# EAGLE design watering_board (EAGLE 9.6.2)
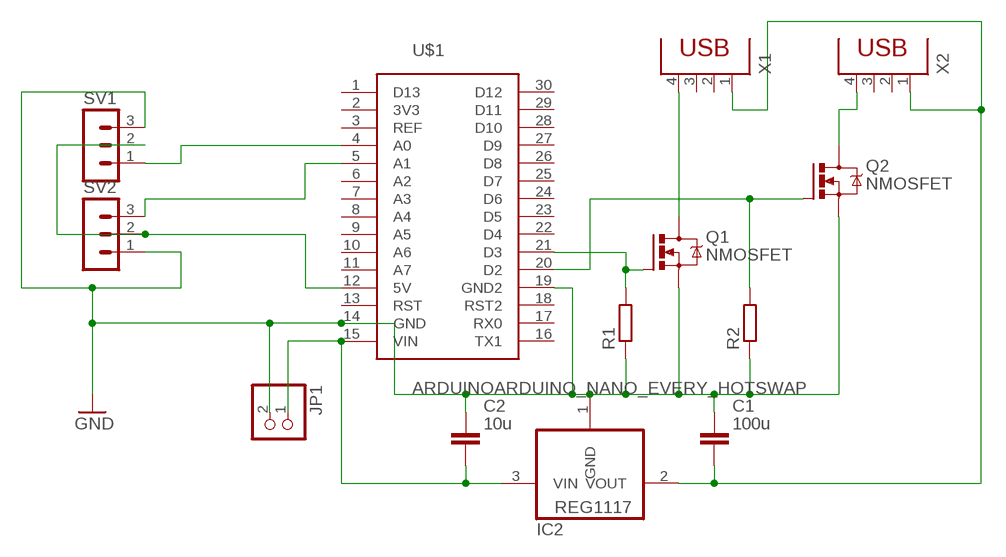
[diagram p0: schematic, sheet 1]

## Parts
C1  100u  C_CHIP-1206(3216-METRIC)  [CAPC3216X135]
C2  10u  C_CHIP-1206(3216-METRIC)  [CAPC3216X135]
IC2  REG1117  [SOT223]
JP1  PINHD-1X2  [1X02]
Q1  NMOSFET  NMOSFETSOT23  [SOT23]
Q2  NMOSFET  NMOSFETSOT23  [SOT23]
R1  R-EU_M1206  [M1206]
R2  R-EU_M1206  [M1206]
SV1  MA03-1  [MA03-1]
SV2  MA03-1  [MA03-1]
U$1  ARDUINOARDUINO_NANO_EVERY_HOTSWAP  [DIP1524W80P254L4318H508Q30B]
X1  PN87520  [PN87520]
X2  PN87520  [PN87520]

## Nets
GND: C1.1 C2.1 IC2.1(GND) JP1.2 Q1.2(S) Q2.2(S) R1.1 R2.1 SV1.3 SV2.1 U$1.14(GND) U$1.19(GND2)
N$1: SV1.1 U$1.4(A0)
N$2: SV2.3 U$1.5(A1)
N$3: SV1.2 SV2.2 U$1.12(5V)
N$4: C2.2 IC2.3(VIN) JP1.1 U$1.15(VIN)
N$5: Q2.1(G) R2.2 U$1.20(D2)
N$6: Q1.3(D) X1.4
N$7: Q2.3(D) X2.4
N$8: Q1.1(G) R1.2 U$1.21(D3)
N$9: C1.2 IC2.2(VOUT) X1.1 X2.1
Unconnected: U$1.1(D13) U$1.3(REF) U$1.6(A2) U$1.7(A3) U$1.8(A4) U$1.9(A5) U$1.10(A6) U$1.11(A7) U$1.13(RST) U$1.16(TX1) U$1.17(RX0) U$1.18(RST2) U$1.22(D4) U$1.23(D5) U$1.24(D6) U$1.25(D7) U$1.26(D8) U$1.27(D9) U$1.28(D10) U$1.29(D11) U$1.30(D12) X1.2 X1.3 X2.2 X2.3

## Power pins joined to a net without a drawn wire
3V3: U$1.2(3V3)

## Library data of the parts
C1 C2 = Capacitor:C: Capacitor - Generic; CATEGORY: Capacitor
IC2 = burr-brown:REG1117: 800mA and 1A Low Dropout (LDO) Positive Regulator 1.8V, 2.5V, 2.85V, 3.3V, 5V, and Adj; MPN: REG1117; OC_FARNELL: 1097566; OC_NEWARK: 14P6981
JP1 = pinhead:PINHD-1X2: PIN HEADER
Q1 Q2 = Transistor:NMOSFET: N-Channel MOSFET - Generic; CATEGORY: Transistor; SUB-CATEGORY: MOSFET; TYPE: N-Channel
R1 R2 = rcl:R-EU_: RESISTOR, European symbol; SPICEPREFIX: R
SV1 SV2 = con-lstb:MA03-1: PIN HEADER; OC_FARNELL: unknown; OC_NEWARK: unknown
U$1 = eScooter:ARDUINO: Ardino nano
X1 X2 = con-berg:PN87520: BERG USB connector; OC_FARNELL: unknown; OC_NEWARK: unknown

## Board
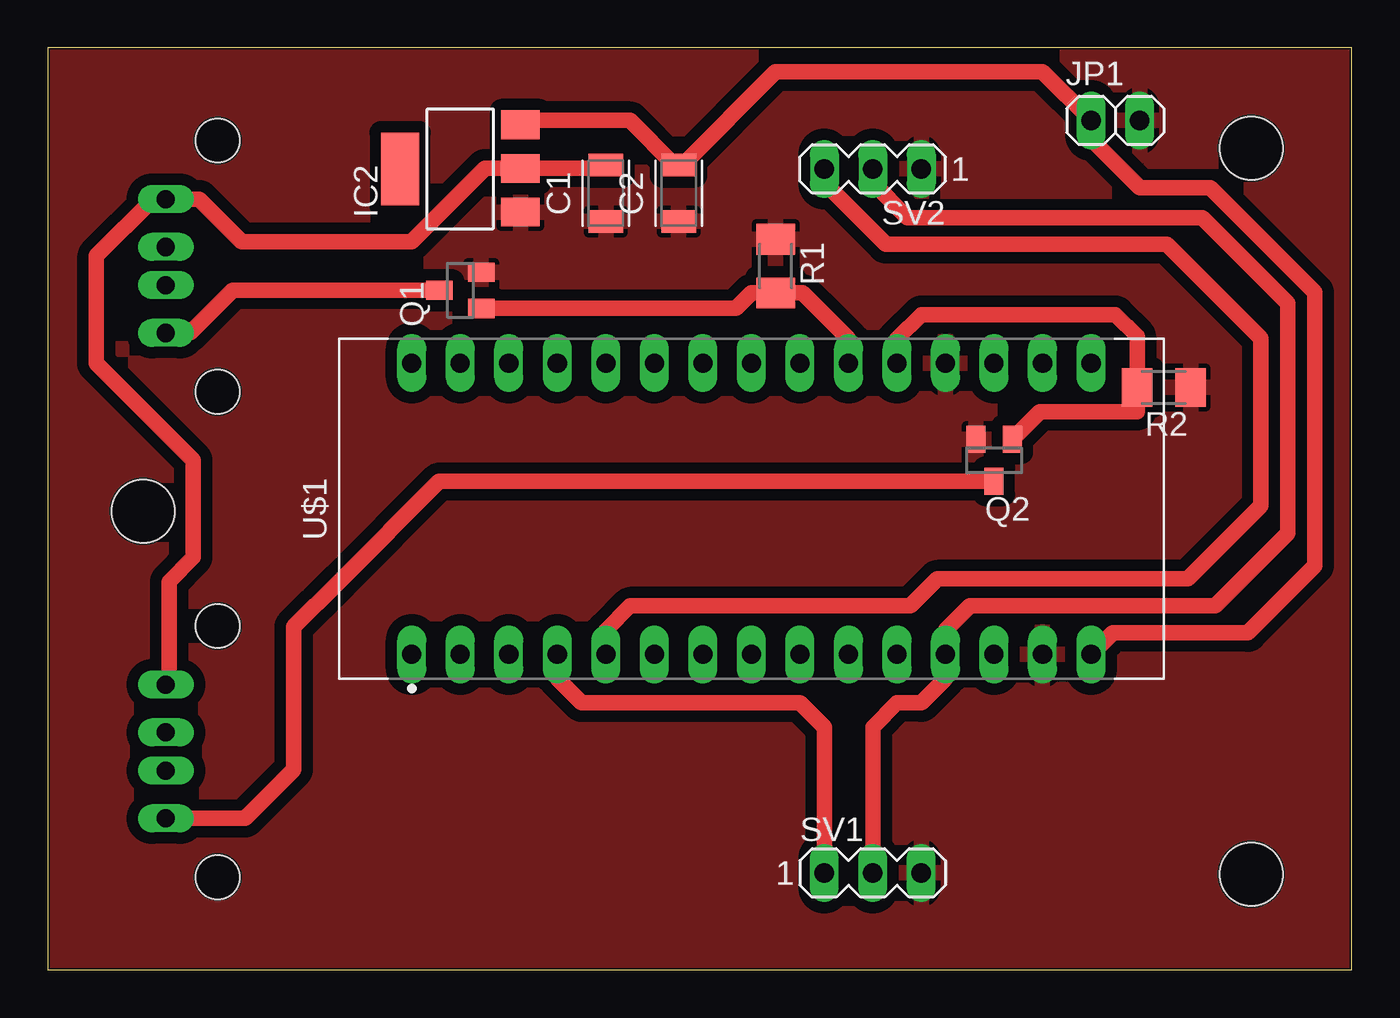
[diagram p1: board, top side]
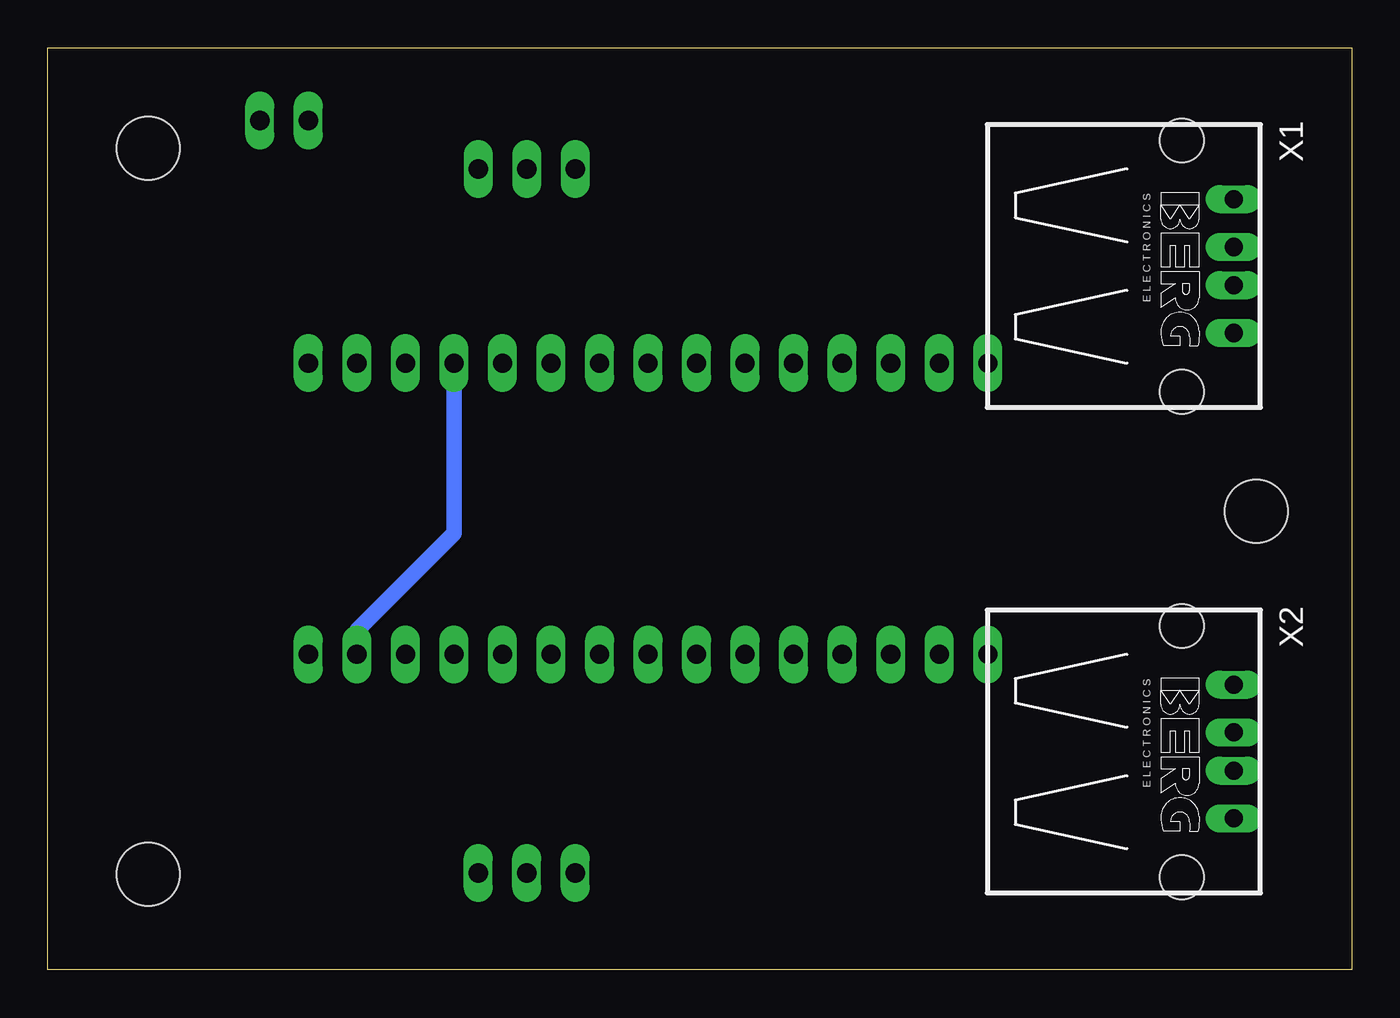
[diagram p2: board, bottom side, seen from below]

Size 68.25 x 48.25 mm. Coordinates in mm from the lower left corner, seen from the top.
Outline: 0,0 68.25,0 68.25,48.25 0,48.25 0,0
Copper layers (1*16): Top 0.035mm / dielectric 1.5mm / Bottom 0.035mm
Design rules "default *": minimum track width 0.8mm, minimum drill 0.35mm, track to track 0.6mm, track to pad 0.6mm, pad to pad 0.6mm, via to via 0.6mm, smd to smd 0.1mm, copper to edge 0.1mm, drill to drill 6mil, minimum pad ring 10mil, minimum via ring 8mil, stop-mask expansion 4mil, vias tented up to drill 0mil, thermal gap 10mil
Holes 3.3 mm at 5,24 63,43 63,5

### Footprints (pad centres in the part's own frame; a part is rotated, then mirrored left to right if it is on the bottom)
CAPC3216X135 = smd 1.165 x 1.815: 1 -1.475,0; 2 1.475,0
SOT223 = smd 1.499 x 2.007: 1 -2.261,-3.15; 2 0.025,-3.15; 3 2.311,-3.15 | smd 3.81 x 2.007: 4 0,3.15
1X02 = drill 1.016 long: 1 -1.27,0; 2 1.27,0
SOT23 = smd 1 x 1.4: 1 -0.95,-1.1; 2 0.95,-1.1; 3 0,1.1
M1206 = smd 1.6 x 2: 1 -1.4,0; 2 1.4,0
MA03-1 = drill 1.016 long: 1 -2.54,0; 2 0,0; 3 2.54,0
DIP1524W80P254L4318H508Q30B = drill 1 long: 1 -7.62,17.78; 2 -7.62,15.24; 3 -7.62,12.7; 4 -7.62,10.16; 5 -7.62,7.62; 6 -7.62,5.08; 7 -7.62,2.54; 8 -7.62,0; 9 -7.62,-2.54; 10 -7.62,-5.08; 11 -7.62,-7.62; 12 -7.62,-10.16; 13 -7.62,-12.7; 14 -7.62,-15.24; 15 -7.62,-17.78; 16 7.62,-17.78; 17 7.62,-15.24; 18 7.62,-12.7; 19 7.62,-10.16; 20 7.62,-7.62; 21 7.62,-5.08; 22 7.62,-2.54; 23 7.62,0; 24 7.62,2.54; 25 7.62,5.08; 26 7.62,7.62; 27 7.62,10.16; 28 7.62,12.7; 29 7.62,15.24; 30 7.62,17.78
PN87520 = drill 0.95 long: 1 -3.5,2.71; 2 -1,2.71; 3 1,2.71; 4 3.5,2.71 | hole 2.3: -6.57,0; 6.57,0

### Placement (x,y rotation side)
C1  29.21,40.64 90 top
C2  33.02,40.64 90 top
IC2  21.59,41.91 90 top
JP1  55.88,44.45 0 top
Q1  21.59,35.56 90 top
Q2  49.53,26.67 180 top
R1  38.1,36.83 270 top
R2  58.42,30.48 180 top
SV1  43.18,5.08 0 top
SV2  43.18,41.91 180 top
U$1  36.83,24.13 90 top
X1  8.89,36.83 270 bottom
X2  8.89,11.43 270 bottom

### Tracks (layer width: path | path; a pad name or v marks a point on that pad's centre or on a via)
GND
  Bottom 0.813: U$1.19 46.99,22.86 52.07,17.78 U$1.14
  pour Top: 0,0 68.58,0 68.58,48.26 0,48.26
N$1
  Top 0.813: U$1.4 26.67,15.24 27.94,13.97 39.37,13.97 40.64,12.7 SV1.1
N$2
  Top 0.8: U$1.5 29.21,17.78 30.48,19.05 45.15,19.05 46.56,20.46 59.68,20.46 63.5,24.28 63.49,33.05 58.57,37.97 43.87,37.97 40.64,41.2 SV2.3
N$3
  Top 0.8: U$1.12 46.99,17.78 48.26,19.05 61.11,19.05 64.91,22.85 64.91,34.88 60.42,39.37 45.01,39.37 43.18,41.2 SV2.2 | 45.72,13.97 44.45,13.97 43.18,12.7 SV1.2
  Top 0.813: 45.72,13.97 46.99,15.24 U$1.12
N$4
  Top 0.8: 52.07,46.99 38.1,46.99 33.23,42.12 C2.2 32.81,42.12 30.48,44.45 24.97,44.45 IC2.3 | 54.79,44.27 JP1.1 54.61,43.46 57.15,40.92 60.86,40.92 66.32,35.46 66.32,21.15 62.81,17.64 55.74,17.64 U$1.15
  Top 0.813: JP1.1 52.07,46.99
N$5
  Top 0.8: Q2.1 51.92,29.21 57.02,29.21 R2.2 57.02,33.15 55.88,34.29
  Top 0.813: 55.88,34.29 45.72,34.29 44.45,33.02 U$1.20
N$6
  Top 0.8: X1.4 7.45,33.33 9.68,35.56 Q1.3
N$7
  Top 0.8: 15.24,20.32 20.49,25.57 Q2.3 | X2.4 10.33,7.93
  Top 0.813: 15.24,20.32 12.87,17.95 12.87,10.47 10.33,7.93
N$8
  Top 0.8: Q1.1 36.01,34.61 36.83,35.43 R1.2 39.5,35.43 40.32,34.61
  Top 0.813: U$1.21 41.91,33.02 40.32,34.61
N$9
  Top 0.8: C1.2 29.03,41.94 IC2.2 | 2.54,36.83 2.54,37.36 5.51,40.33 X1.1 7.93,40.33
  Top 0.813: X2.1 6.35,15.1 6.35,20.32 7.62,21.59 7.62,26.67 2.54,31.75 2.54,36.83 | 7.93,40.33 10.16,38.1 19.05,38.1 22.89,41.94 IC2.2